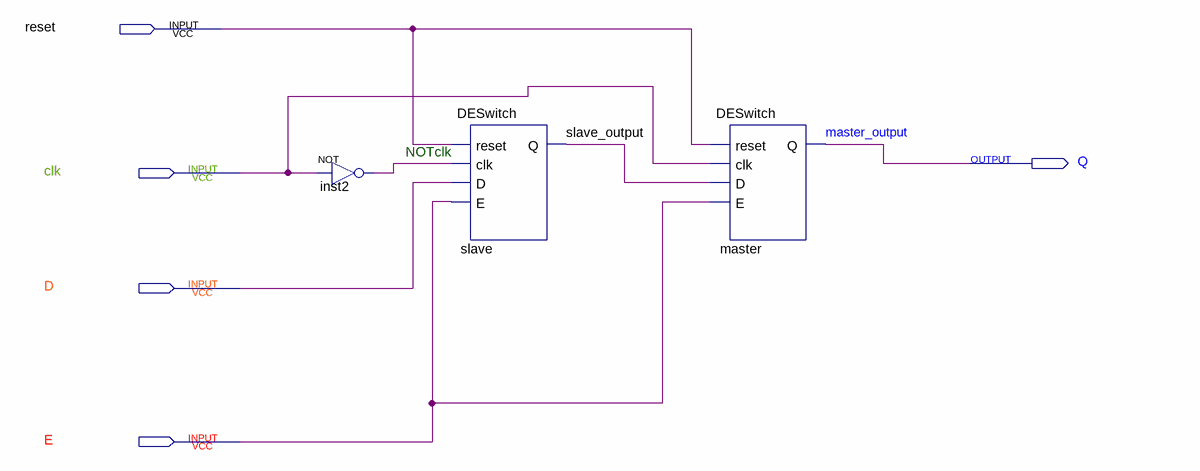
[diagram p0: schematic sheet]
// Quartus schematic RegisterE.bdf as structural Verilog: 3 symbols, 5 pins
module RegisterE (
  input  reset,
  input  clk,
  input  D,
  input  E,
  output Q
);

  wire NOTclk, slave_output;

  not inst2 (NOTclk, clk);
  DESwitch slave (.reset(reset), .clk(NOTclk), .D(D), .E(E), .Q(slave_output));
  DESwitch master (.reset(reset), .clk(clk), .D(slave_output), .E(E), .Q(Q));

  // Other names for the same wires on the sheet: master_output = Q
endmodule
